# Altium schematic sheet battery_lcl-discharging.SchDoc: Battery Discharger - LCL
size A4; Date: 2015-09-21; Author: Piotr Kuligowski; DocumentNumber: 1; Revision: 1-0; SheetNumber: 1; SheetTotal: 14; Model: EM1
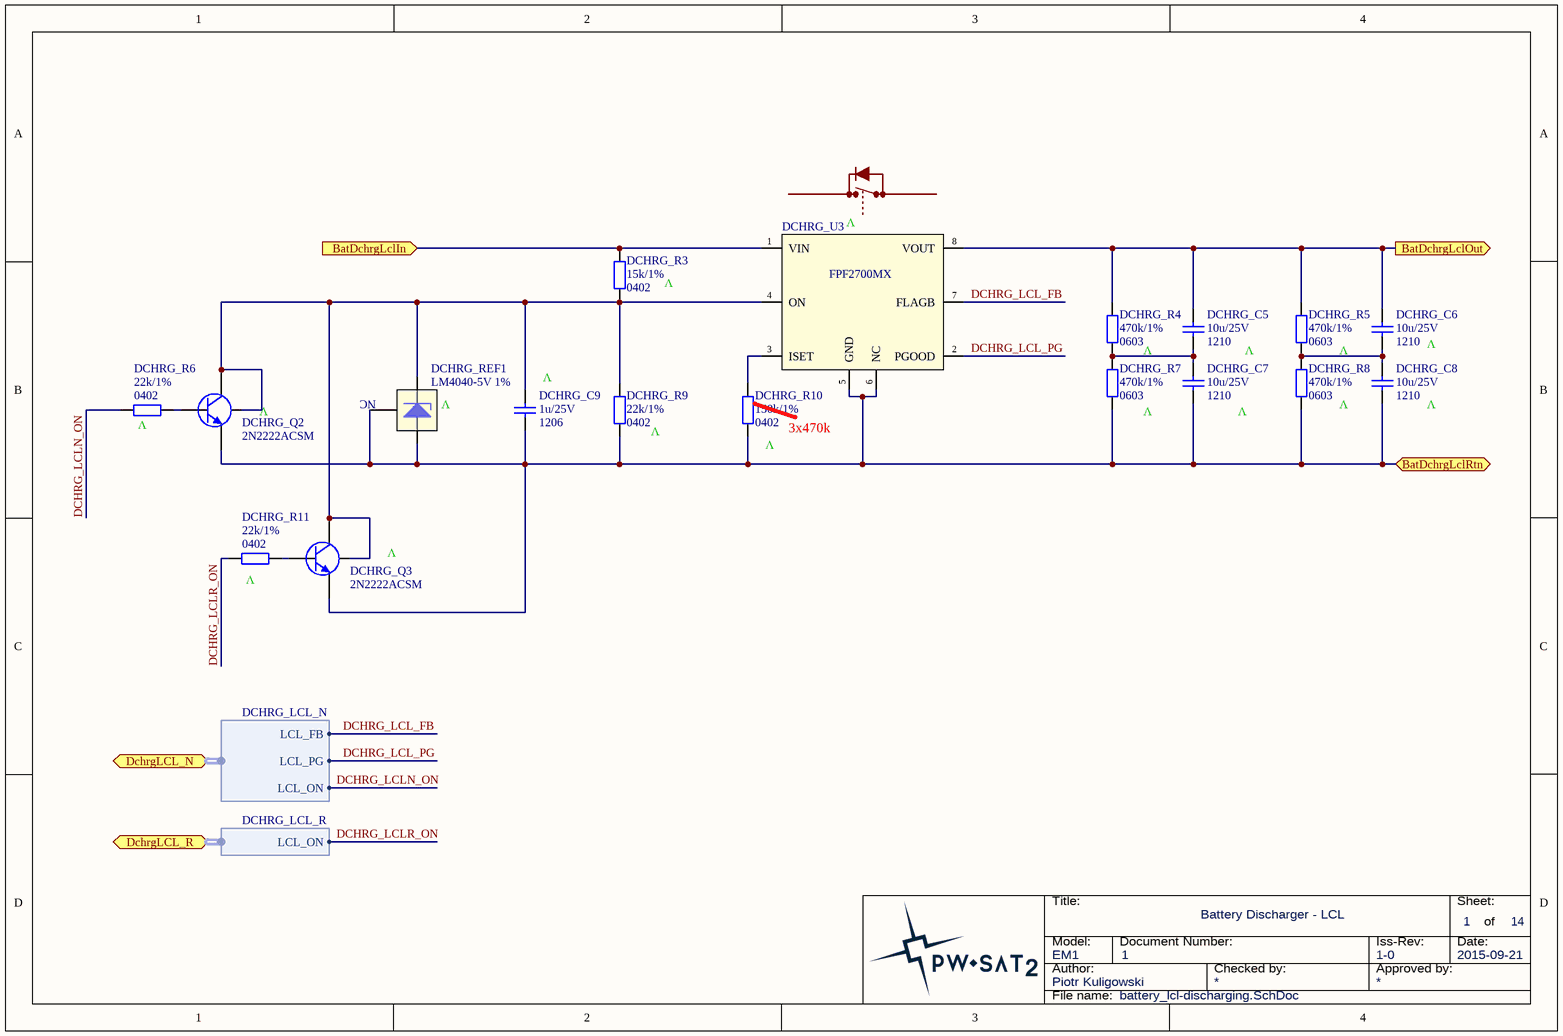
[diagram p0: battery_lcl-discharging.SchDoc]

## Parts
DCHRG_C5  Package: 1210  [SMD_Capacitor_1210]  (hidden comment: 10u/25V)
DCHRG_C6  Package: 1210  [SMD_Capacitor_1210]  (hidden comment: 10u/25V)
DCHRG_C7  Package: 1210  [SMD_Capacitor_1210]  (hidden comment: 10u/25V)
DCHRG_C8  Package: 1210  [SMD_Capacitor_1210]  (hidden comment: 10u/25V)
DCHRG_C9  Package: 1206  [SMD_Capacitor_1206]  (hidden comment: 1u/25V)
DCHRG_Q2  2N2222ACSM  [LCC1-4_BEC]
DCHRG_Q3  2N2222ACSM  [LCC1-4_BEC]
DCHRG_R3  Package: 0402  [SMD_Resistor_0402]  (hidden comment: 15k/1%)
DCHRG_R4  Package: 0603  [SMD_Resistor_0603]  (hidden comment: 470k/1%)
DCHRG_R5  Package: 0603  [SMD_Resistor_0603]  (hidden comment: 470k/1%)
DCHRG_R6  Package: 0402  [SMD_Resistor_0402]  (hidden comment: 22k/1%)
DCHRG_R7  Package: 0603  [SMD_Resistor_0603]  (hidden comment: 470k/1%)
DCHRG_R8  Package: 0603  [SMD_Resistor_0603]  (hidden comment: 470k/1%)
DCHRG_R9  Package: 0402  [SMD_Resistor_0402]  (hidden comment: 22k/1%)
DCHRG_R10  Package: 0402  [SMD_Resistor_0402]  (hidden comment: 150k/1%)
DCHRG_R11  Package: 0402  [SMD_Resistor_0402]  (hidden comment: 22k/1%)
DCHRG_REF1  LM4040-5V 1%  [SOT23-3]
DCHRG_U3  FPF2700MX  [SOIC-8-N]

## Ports
BatDchrgLclIn (in), BatDchrgLclOut (out), BatDchrgLclRtn, DchrgLCL_N (harness DCHRG_LCL_N), DchrgLCL_R (harness DCHRG_LCL_R)

## Harnesses
DCHRG_LCL_N: LCL_FB, LCL_PG, LCL_ON
DCHRG_LCL_R: LCL_ON

## Nets
BatDchrgLclIn: DCHRG_R3.1 DCHRG_U3.1(VIN) ; port BatDchrgLclIn
BatDchrgLclOut: DCHRG_C5.1 DCHRG_C6.1 DCHRG_R4.1 DCHRG_R5.1 DCHRG_U3.8(VOUT) ; port BatDchrgLclOut
BatDchrgLclRtn: DCHRG_C7.2 DCHRG_C8.2 DCHRG_C9.2 DCHRG_Q2.E DCHRG_Q3.E DCHRG_R7.2 DCHRG_R8.2 DCHRG_R9.2 DCHRG_R10.2 DCHRG_REF1.2(A) DCHRG_REF1.3(NC) DCHRG_U3.5(GND) DCHRG_U3.6(NC) ; port BatDchrgLclRtn
DCHRG_LCL_FB: DCHRG_U3.7(FLAGB) ; port DchrgLCL_N.LCL_FB
DCHRG_LCL_PG: DCHRG_U3.2(PGOOD) ; port DchrgLCL_N.LCL_PG
DCHRG_LCLN_ON: DCHRG_R6.2 ; port DchrgLCL_N.LCL_ON
DCHRG_LCLR_ON: DCHRG_R11.2 ; port DchrgLCL_R.LCL_ON
NetDCHRG_C5_2: DCHRG_C5.2 DCHRG_C7.1 DCHRG_R4.2 DCHRG_R7.1
NetDCHRG_C6_2: DCHRG_C6.2 DCHRG_C8.1 DCHRG_R5.2 DCHRG_R8.1
NetDCHRG_C9_1: DCHRG_C9.1 DCHRG_Q2.C DCHRG_Q2.Shield DCHRG_Q3.C DCHRG_Q3.Shield DCHRG_R3.2 DCHRG_R9.1 DCHRG_REF1.1(K) DCHRG_U3.4(ON)
NetDCHRG_Q2_B: DCHRG_Q2.B DCHRG_R6.1
NetDCHRG_Q3_B: DCHRG_Q3.B DCHRG_R11.1
NetDCHRG_R10_1: DCHRG_R10.1 DCHRG_U3.3(ISET)

## Notes on the sheet
- (near DCHRG_U3) V
- V
- (near DCHRG_C9) V
- (near DCHRG_R6) V
- (near DCHRG_Q2) V
- (near DCHRG_REF1) V
- (near DCHRG_R9) V
- (near DCHRG_R10) V
- 3x470k
- (near DCHRG_C8) V
- (near DCHRG_R11) V
- Title:
- Sheet:
- of
- Author:
- Model:
- Document Number:
- Checked by:
- Iss-Rev:
- Approved by:
- Date:
- File name:

## Library data of the parts
DCHRG_C5-DCHRG_C8 = Cer_GCJ32ER71E106KA12L: Ceramic Cap Murata Automotive 10u/25V X7R 1210; Manufacturer: Murata; ManufacturerPartNumber: GCJ32ER71E106KA12L; Value: 10u/25V
DCHRG_C9 = Cer_C1206T105K3RALTU: Ceramic Cap Kemet COTS 1u/25V X7R 1206; ManufacturerPartNumber: C1206T105K3RALTU; Manufacturer: Kemet; Value: 1u/25V
DCHRG_Q2 DCHRG_Q3 = 2N2222ACSM: Silicon Planar Epitaxial NPN Transistor.; Manufacturer: Semelab-TT; Value: 2N2222ACSM
DCHRG_R3 = CRCW040215K0FKxxxx: 15k/1% Vishay CRCW 0402 Resistor. 63mW, 100ppm, 50V.; Manufacturer: Vishay; ManufacturerPartNumber: CRCW040215K0FKxxxx; Value: 15k/1%
DCHRG_R4 DCHRG_R5 DCHRG_R7 DCHRG_R8 = CRCW0603470KFKxxxx: 470k/1% Vishay CRCW 0603 Resistor. 100mW, 100ppm, 75V.; Manufacturer: Vishay; ManufacturerPartNumber: CRCW0603470KFKxxxx; Value: 470k/1%
DCHRG_R6 DCHRG_R9 DCHRG_R11 = CRCW040222K0FKxxxx: 22k/1% Vishay CRCW 0402 Resistor. 63mW, 100ppm, 50V.; Manufacturer: Vishay; ManufacturerPartNumber: CRCW040222K0FKxxxx; Value: 22k/1%
DCHRG_R10 = CRCW0402150KFKxxxx: 150k/1% Vishay CRCW 0402 Resistor. 63mW, 100ppm, 50V.; Manufacturer: Vishay; ManufacturerPartNumber: CRCW0402150KFKxxxx; Value: 150k/1%
DCHRG_REF1 = LM4040DIM3-5.0: Shunt V-REF, 5V, 1%, SOT23-3; Manufacturer: Texas Instruments; ManufacturerPartNumber: LM4040DIM3-5.0; Value: LM4040-5V 1%
DCHRG_U3 = FPF2700MX: Adj over-current protection 0.4-2A, Load Switch; Manufacturer: Fairchild Semiconductor; Value: FPF2700MX